# Altium schematic sheet Comu_485.SchDoc
size A4; DocumentNumber: 5; SheetNumber: 5; SheetTotal: 11
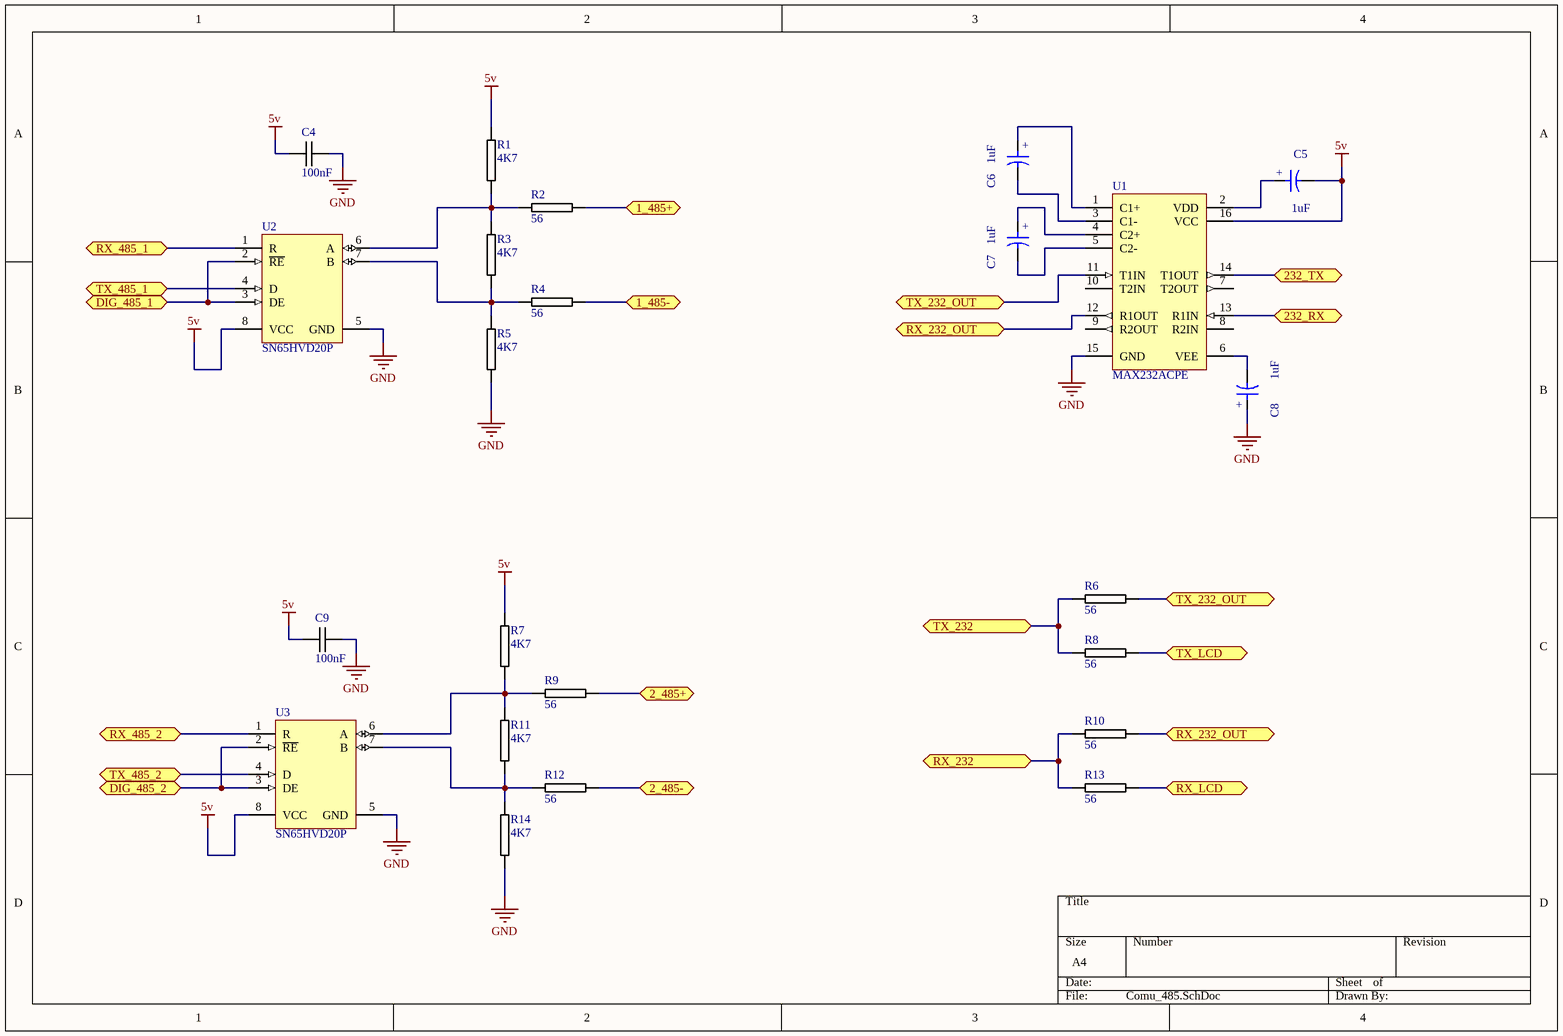
[diagram p0: Comu_485.SchDoc]

## Parts
C4  100nF  [0805C-TBD]
C5  1uF  [CAPPRB254-450X710]
C6  1uF  [CAPPRB254-450X710]
C7  1uF  [CAPPRB254-450X710]
C8  1uF  [CAPPRB254-450X710]
C9  100nF  [0805C-TBD]
R1  4K7  [0805R-4K7]
R2  56  [0805R-56]
R3  4K7  [0805R-4K7]
R4  56  [0805R-56]
R5  4K7  [0805R-4K7]
R6  56  [0805R-56]
R7  4K7  [0805R-4K7]
R8  56  [0805R-56]
R9  56  [0805R-56]
R10  56  [0805R-56]
R11  4K7  [0805R-4K7]
R12  56  [0805R-56]
R13  56  [0805R-56]
R14  4K7  [0805R-4K7]
U1  MAX232ACPE  [PE16A]
U2  SN65HVD20P  [P8]
U3  SN65HVD20P  [P8]

## Ports
1_485+, 1_485-, 2_485+, 2_485-, 232_RX, 232_TX, DIG_485_1 (bidir), DIG_485_2 (bidir), RX_232, RX_232_OUT, RX_485_1, RX_485_2, RX_LCD, TX_232, TX_232_OUT, TX_485_1 (bidir), TX_485_2 (bidir), TX_LCD

## Nets
5v: C4.1 C5.2 C9.1 R1.1 R7.1 U1.16(VCC) U2.8(VCC) U3.8(VCC)
GND: C4.2 C8.1 C9.2 R5.2 R14.2 U1.15(GND) U2.5(GND) U3.5(GND)
1_485+: R2.2 ; port 1_485+
1_485-: R4.2 ; port 1_485-
2_485+: R9.2 ; port 2_485+
2_485-: R12.2 ; port 2_485-
232_RX: U1.13(R1IN) ; port 232_RX
232_TX: U1.14(T1OUT) ; port 232_TX
DIG_485_1: U2.2(~{RE}) U2.3(DE) ; port DIG_485_1
DIG_485_2: U3.2(~{RE}) U3.3(DE) ; port DIG_485_2
RX_232: R10.1 R13.1 ; port RX_232
RX_232_OUT: R10.2 U1.12(R1OUT) ; port RX_232_OUT
RX_485_1: U2.1(R) ; port RX_485_1
RX_485_2: U3.1(R) ; port RX_485_2
RX_LCD: R13.2 ; port RX_LCD
TX_232: R6.1 R8.1 ; port TX_232
TX_232_OUT: R6.2 U1.11(T1IN) ; port TX_232_OUT
TX_485_1: U2.4(D) ; port TX_485_1
TX_485_2: U3.4(D) ; port TX_485_2
TX_LCD: R8.2 ; port TX_LCD
NetC5_1: C5.1 U1.2(VDD)
NetC6_1: C6.1 U1.1(C1+)
NetC6_2: C6.2 U1.3(C1-)
NetC7_1: C7.1 U1.4(C2+)
NetC7_2: C7.2 U1.5(C2-)
NetC8_2: C8.2 U1.6(VEE)
NetR1_2: R1.2 R2.1 R3.1 U2.6(A)
NetR3_2: R3.2 R4.1 R5.1 U2.7(B)
NetR7_2: R7.2 R9.1 R11.1 U3.6(A)
NetR11_2: R11.2 R12.1 R14.1 U3.7(B)

Not connected (* = marked no-connect by the designer): U1 7(T2OUT) 8(R2IN) 9(R2OUT) 10(T2IN)

## Notes on the sheet
- (in symbol CTEB_1UF_35V_10%_254-450X710) +

## Library data of the parts
C4 C9 = 0805C-100nF-25V-X7R-MUR: CAPACITOR 0805 CERAMIC; Supplier 1: Digi-Key; Supplier Part Number 1: 490-1673-1-ND
C5-C8 = CTEB_1UF_35V_10%_254-450X710: Polarised capacitor; Part Description: Solid Tantalum Resin Dipped Capacitor; Manufacturer: KEMET; Manufacturer Part Number: T350A105K035AT; Voltage: 35V; Tolerance: ±10%; Table: Capacitors THD; Part Number: CTEB_1UF_35V_10%_254-450X710; Component Kind: Standard; Component Type: Standard; Pin Count: 2; Value: 1uF; Status: None; Case: LS2.54 D4.5 x H7.1; Mounted: Yes; Socket: No; SMD: No; ComponentHeight: 7.1mm; HelpURL: \\cern.ch\dfs\Applications\Altium\Datasheets\CTEB_KEMET_T350.pdf; Author: CERN DEM JLC; CreateDate: 16/12/2009; LatestRevisionDate: 16/12/2009
R1 R3 R5 R7 R11 R14 = 0805R-4K7: RESISTOR 0805 1/4 WATT THIN FILM; Reel: *
R2 R4 R6 R8-R10 R12 R13 = 0805R-56: RESISTOR 0805 1/4 WATT THIN FILM; Reel: *
U1 = MAX232ACPE: +5V Powered, Multi-Channel RS-232 Driver/Receiver; Published: 16-Jan-2001; LatestRevisionDate: 29-May-2009; LatestRevisionNote: Component Body Added.; PackageVersion: 1997; PackageReference: PE16A; Publisher: Altium Limited; PackageDescription: DIP, 16-Pin, Row Spacing 7.62 mm, Pitch 2.54 mm; Code_JEDEC: MS-001-BB; ComponentLink1Description: Manufacturer Link; ComponentLink1URL: http://www.maxim-ic.com/; ComponentLink2Description: Datasheet; ComponentLink2URL: http://pdfserv.maxim-ic.com/en/ds/MAX220-MAX249.pdf
U2 U3 = SN65HVD20P: Extended Common-mode RS-485 Transceiver, 25 Mbps, 5 V, Half Duplex, -40 to 85 degC, 8-pin PDIP (P), Pb-Free (RoHS); Manufacturer: Texas Instruments; Eco-Plan: Green (RoHS & no Sb/Br); # of TX/RX: 1 TX / 1 RX; Drivers Per Package: 1; Isolated: No; Number of Nodes: 64; Signaling Rate(Mbps): 25; Common Mode Range: -20 to 25; ESD(kV): 16; Fault Protection(V): -27 to 27; Fail Safe: Idle, Open, Short; ICC(Max)(mA): 9; Supply Voltage(s)(V): 5; Rating: Catalog; DatasheetVersion: SLLS552E; PackageVersion: revE, Apr-2010; PackageReference: P8; PackageDescription: 8-Pin Plastic Dual-In-Line Package, Row Spacing 7.62 mm, Pitch 2.54 mm; Supplier 1: Digi-Key; Supplier Part Number 1: SN65HVD20P-ND; Supplier 2: Mouser; Supplier Part Number 2: 595-SN65HVD20P; SubFamily: RS-485; Receivers Per Package: 1; Duplex: Half; Footprint: SN75176; Mounting Technology: Through-hole; PartNumber: SN65HVD20P; Code_JEDEC: MS-001-BA; ComponentLink1Description: Datasheet; ComponentLink1URL: http://www.ti.com/general/docs/lit/getliterature.tsp?genericPartNumber=SN65HVD20&fileType=pdf; ComponentLink2Description: Package Specification; ComponentLink2URL: http://www.ti.com/litv/pdf/mpdi001b